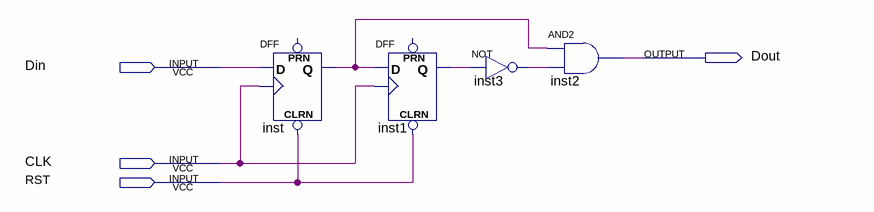
[diagram p0: schematic sheet]
// Quartus schematic Trigger.bdf as structural Verilog: 4 symbols, 4 pins
module Trigger (
  input  Din,
  input  CLK,
  input  RST,
  output Dout
);

  wire inst1_q, inst3_out, inst_q;

  DFF inst (.CLRN(RST), .CLK(CLK), .D(Din), .Q(inst_q));  // open: PRN
  DFF inst1 (.CLRN(RST), .CLK(CLK), .D(inst_q), .Q(inst1_q));  // open: PRN
  not inst3 (inst3_out, inst1_q);
  and inst2 (Dout, inst_q, inst3_out);
endmodule
